# EAGLE schematic DMXtoMotionPCB-v2 (EAGLE 7.5.0)

## Sheet 1 of 2: Sheet1
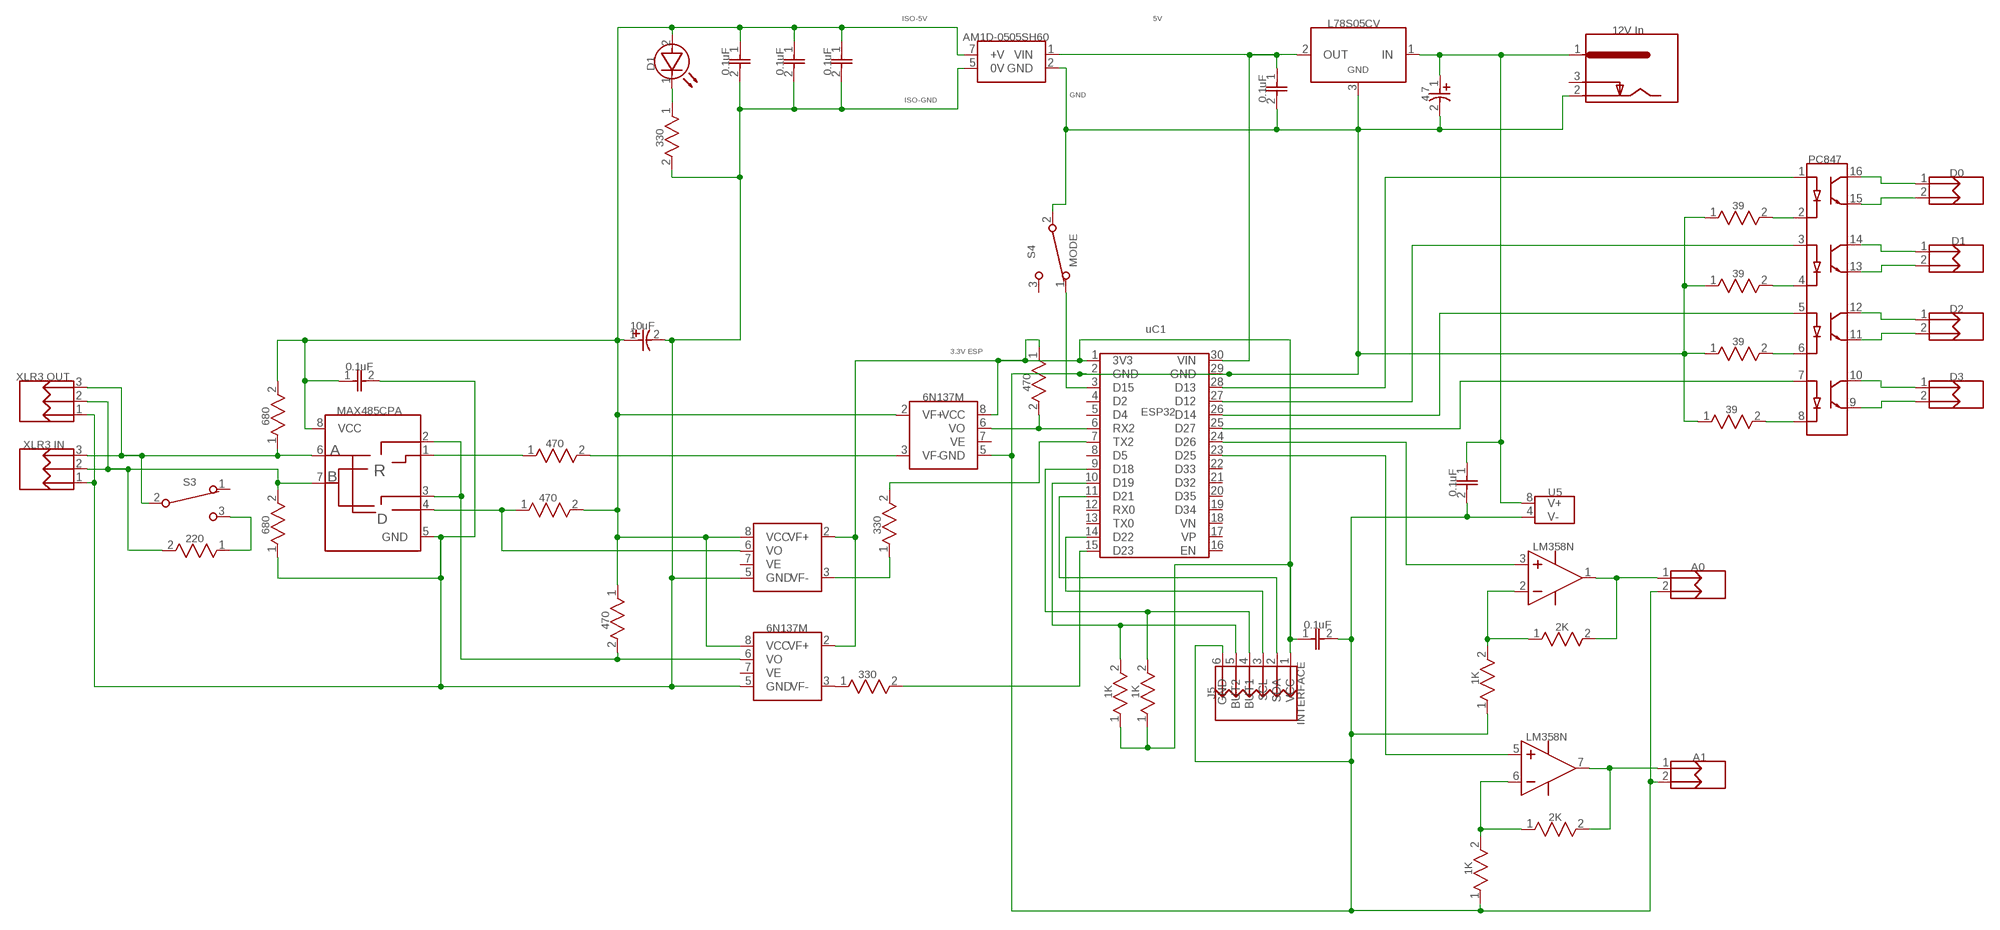
[diagram p0: schematic, sheet 1]

### Parts
C1  0.1uF  CAP_NONPOLARIZED  [CAP-5.08/9.15X3]
C2  0.1uF  CAP_NONPOLARIZED  [CAP-5.08/9.15X3]
C3  0.1uF  CAP_NONPOLARIZED  [CAP-5.08/9.15X3]
C4  4.7  CAP100RP  [CAPPR-2.54/5.08]
C5  10uF  CAP100RP  [CAPPR-2.54/5.08]
C6  0.1uF  CAP_NONPOLARIZED  [CAP-5.08/9.15X3]
C7  0.1uF  CAP_NONPOLARIZED  [CAP-5.08/9.15X3]
C8  0.1uF  CAP_NONPOLARIZED  [CAP-5.08/9.15X3]
C9  0.1uF  CAP_NONPOLARIZED  [CAP-5.08/9.15X3]
D1  LED  [LED100]
J1  12V In  4840-2201  [4840-2211]
J2  XLR3 IN  MOLEX_1X3  [HDR-1X3]
J3  XLR3 OUT  MOLEX_1X3  [HDR-1X3]
J4  D1  MOLEX_1X2  [HDR-1X2]
J5  INTERFACE  MOLEX-1X6  [HDR-1X6]
J6  A0  MOLEX_1X2  [HDR-1X2]
J7  A1  MOLEX_1X2  [HDR-1X2]
J8  D0  MOLEX_1X2  [HDR-1X2]
J9  D3  MOLEX_1X2  [HDR-1X2]
J10  D2  MOLEX_1X2  [HDR-1X2]
R1  330  RES500  [RES-12.7/7.6X2.5]
R2  330  RES500  [RES-12.7/7.6X2.5]
R3  330  RES500  [RES-12.7/7.6X2.5]
R4  470  RES500  [RES-12.7/7.6X2.5]
R5  470  RES500  [RES-12.7/7.6X2.5]
R6  470  RES500  [RES-12.7/7.6X2.5]
R7  680  RES500  [RES-12.7/7.6X2.5]
R8  680  RES500  [RES-12.7/7.6X2.5]
R9  1K  RES500  [RES-12.7/7.6X2.5]
R10  1K  RES500  [RES-12.7/7.6X2.5]
R12  220  RES500  [RES-12.7/7.6X2.5]
R13  470  RES500  [RES-12.7/7.6X2.5]
R14  39  RES500  [RES-12.7/7.6X2.5]
R15  39  RES500  [RES-12.7/7.6X2.5]
R16  39  RES500  [RES-12.7/7.6X2.5]
R17  39  RES500  [RES-12.7/7.6X2.5]
R18  1K  RES500  [RES-12.7/7.6X2.5]
R19  2K  RES500  [RES-12.7/7.6X2.5]
R20  1K  RES500  [RES-12.7/7.6X2.5]
R21  2K  RES500  [RES-12.7/7.6X2.5]
S3  SWITCH_SPDT  [HDRF-1X3T/2.54/8X3]
S4  MODE  SWITCH_SPDT  [HDRF-1X3T/2.54/8X3]
U1  AM1D-0505SH60  [SIP-4(7)/19.5X6X2.54]
U2  MAX485CPA  [DIP-8]
U4  L78S05CV  [TO-220V]
U5  LM358N  [DIP-8]
uC1  ESP32-WROOM-DEVKITV1  [ESP32-DEVKITV1]
VO1  6N137M  [DIP-8]
VO2  6N137M_10  [DIP-8]
VO3  6N137M_10  [DIP-8]
VO4  PC847  [DIP-16]

### Nets
3.3V_ESP [POWER]: C7.1 J5.1(VCC) R9.1(A) R10.1(A) R13.1(A) uC1.1(3V3) VO1.8(VCC) VO2.2(VF+) VO3.2(VF+)
5V [POWER]: C9.1 U1.1(VIN) U4.2(OUT) uC1.30(VIN)
12V [POWER]: C4.1(PLUS) C6.1 J1.1 U4.1(IN) U5.8(VCC_AND_GND:V+)
But1: J5.4(BUT1) R10.2(B) uC1.9(D18)
But2: J5.5(BUT2) R9.2(B) uC1.10(D19)
GND [POWER]: C4.2(MINUS) C6.2 C7.2 C9.2 J1.2 J5.6(GND) J6.2 J7.2 R14.1(A) R15.1(A) R16.1(A) R17.1(A) R18.1(A) R20.1(A) S4.2(C1) U1.2(GND) U4.3(GND) U5.4(VCC_AND_GND:V-) uC1.2(GND) uC1.29(GND) VO1.5(GND)
ISO-5V [POWER]: C1.1 C2.1 C3.1 C5.1(PLUS) C8.1 D1.2(A) R5.2(B) R6.1(A) R7.2(B) U1.7(+V) U2.8(VCC) VO1.2(VF+) VO2.8(VCC) VO3.8(VCC)
ISO-GND [POWER]: C1.2 C2.2 C3.2 C5.2(MINUS) C8.2 J2.1 J3.1 R1.2(B) R8.1(A) U1.5(0V) U2.5(GND) VO2.5(GND) VO3.5(GND)
Net_0: R17.2(B) VO4.2(Cathode)
Net_1: uC1.26(D14) VO4.5(Anode)
Net_2: uC1.25(D27) VO4.7(Anode)
Net_4: D1.1(K) R1.1(A)
Net_6: uC1.28(D13) VO4.1(Anode)
Net_7: uC1.27(D12) VO4.3(Anode)
Net_8: U5.5(PART_2:IN+) uC1.23(D25)
Net_9: R2.1(A) VO2.3(VF-)
Net_10: R3.2(B) uC1.15(D23)
Net_11: R3.1(A) VO3.3(VF-)
Net_12: R4.2(B) VO1.3(VF-)
Net_13: R4.1(A) U2.1(RO)
Net_14: R6.2(B) U2.2(!RE) U2.3(DE) VO3.6(VO)
Net_15: R5.1(A) U2.4(DI) VO2.6(VO)
Net_16: J2.2 J3.2 R8.2(B) R12.2(B) U2.7(B)
Net_17: J2.3 J3.3 R7.1(A) S3.2(C1) U2.6(A)
Net_18: J7.1 R19.2(B) U5.7(PART_2:OUT)
Net_21: R18.2(B) R19.1(A) U5.6(PART_2:IN-)
Net_22: S4.1(C2) uC1.3(D15)
Net_24: U5.3(PART_1:IN+) uC1.24(D26)
Net_32: J5.2(SDA) uC1.11(D21)
Net_33: J5.3(SCL) uC1.14(D22)
Net_34: R12.1(A) S3.3(C3)
Net_35: R14.2(B) VO4.4(Cathode)
Net_36: R15.2(B) VO4.6(Cathode)
Net_37: R16.2(B) VO4.8(Cathode)
Net_38: J8.2 VO4.15(Emitter)
Net_39: J8.1 VO4.16(Collector)
Net_40: J4.1 VO4.14(Collector)
Net_41: J4.2 VO4.13(Emitter)
Net_42: J10.1 VO4.12(Collector)
Net_43: J10.2 VO4.11(Emitter)
Net_44: J9.1 VO4.10(Collector)
Net_45: J9.2 VO4.9(Emitter)
Net_46: J6.1 R21.2(B) U5.1(PART_1:OUT)
Net_47: R20.2(B) R21.1(A) U5.2(PART_1:IN-)
RX: R13.2(B) uC1.6(RX2) VO1.6(VO)
TX: R2.2(B) uC1.7(TX2)
Unconnected: S3.1(C2) S4.3(C3) uC1.4(D2) uC1.5(D4) uC1.8(D5) uC1.12(RX0) uC1.13(TX0) uC1.16(EN) uC1.17(VP) uC1.18(VN) uC1.19(D34) uC1.20(D35) uC1.21(D32) uC1.22(D33) VO1.7(VE) VO2.7(VE) VO3.7(VE)

### Notes on the sheet
- ISO-5V | 5V
- L78S05CV
- 12V In
- AM1D-0505SH60
- GND
- D1
- 0.1uF | 0.1uF | 0.1uF
- GND
- ISO-GND
- 0.1uF | 4.7
- 330
- PC847
- D0
- 39
- D1
- S4
- MODE
- 39
- D2
- 10uF
- uC1
- 39
- 3.3V ESP
- 0.1uF
- XLR3 OUT | D3
- 470
- 6N137M
- ESP32
- MAX485CPA | 39
- 680
- XLR3 IN | 470
- A
- R
- B
- S3
- 0.1uF | U5
- 470
- D
- 680 | 330
- 220
- LM358N
- A0
- 470 | 0.1uF | 2K
- 6N137M
- INTERFACE
- 330
- J5 | 1K
- 1K | 1K
- LM358N
- A1
- 2K
- 1K

## Sheet 2 of 2: Sheet2
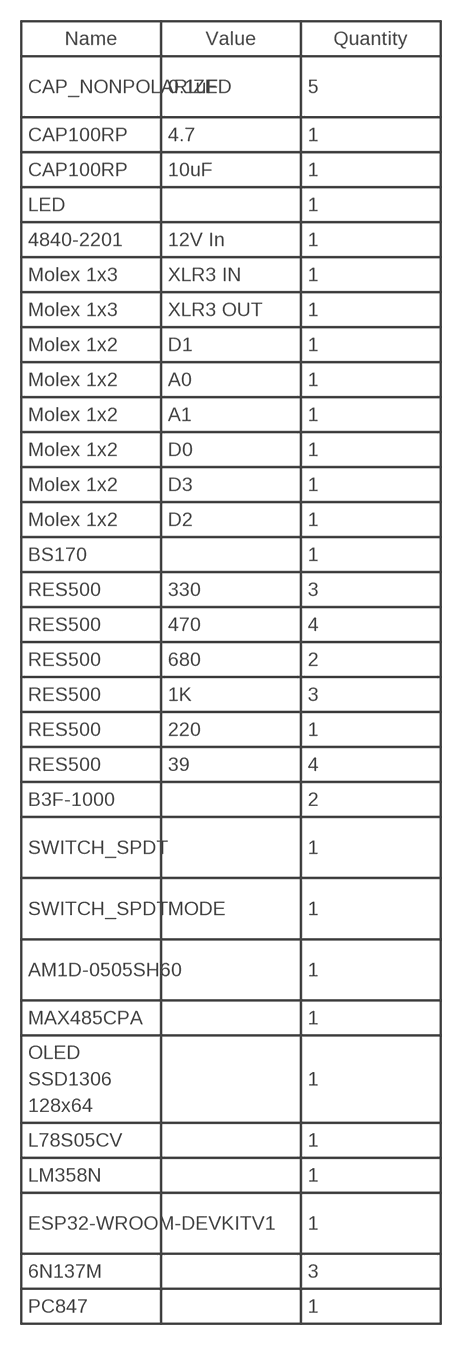
[diagram p1: schematic, sheet 2]

### Notes on the sheet
- Name | Value | Quantity
- CAP_NONPOLARIZED | 0.1uF | 5
- CAP100RP | 4.7 | 1
- CAP100RP | 10uF | 1
- LED | 1
- 4840-2201 | 12V In | 1
- Molex 1x3 | XLR3 IN | 1
- Molex 1x3 | XLR3 OUT | 1
- Molex 1x2 | D1 | 1
- Molex 1x2 | A0 | 1
- Molex 1x2 | A1 | 1
- Molex 1x2 | D0 | 1
- Molex 1x2 | D3 | 1
- Molex 1x2 | D2 | 1
- BS170 | 1
- RES500 | 330 | 3
- RES500 | 470 | 4
- RES500 | 680 | 2
- RES500 | 1K | 3
- RES500 | 220 | 1
- RES500 | 39 | 4
- B3F-1000 | 2
- SWITCH_SPDT | 1
- SWITCH_SPDT | MODE | 1
- AM1D-0505SH60 | 1
- MAX485CPA | 1
- OLED
  SSD1306
  128x64
- 1
- L78S05CV | 1
- LM358N | 1
- ESP32-WROOM-DEVKITV1 | 1
- 6N137M | 3
- PC847 | 1

## Power pins joined to a net without a drawn wire
3: J1.3

## Library data of the parts
C1-C3 C6-C9 = common:CAP_NONPOLARIZED; DESCRIPTION: Non-polarized
C4 = common:CAP100RP
C5 = common:CAP100RP; VALUE: 4.7
D1 = common:LED
J1 = common:4840-2201; DATASHEET: http://datasheets.diptrace.com/con_power/typ_4840.2201.pdf; MANUFACTURER: Schurter
J2 = common:MOLEX_1X3
J3 = common:MOLEX_1X3; VALUE: XLR3 IN
J4 = common:MOLEX_1X2
J5 = common:MOLEX-1X6
J6-J10 = common:MOLEX_1X2; VALUE: D1
R1-R3 = common:RES500
R4-R10 R12-R21 = common:RES500; VALUE: 330
S3 S4 = common:SWITCH_SPDT; DESCRIPTION: Switch; UNTITLED: SPDT; UNTITLED_1: Normally Closed
U1 = common:AM1D-0505SH60; MANUFACTURER: AMTEC
U2 = common:MAX485CPA; DATASHEET: http://datasheets.diptrace.com/maxim/MAX1487-MAX491.pdf; MANUFACTURER: Maxim
U4 = common:L78S05CV; DATASHEET: http://datasheets.diptrace.com/st_micro/CD00000449.pdf; MANUFACTURER: ST Microelectronics
U5 = common:LM358N; DATASHEET: http://datasheets.diptrace.com/motorola/LM158_258_358_2904.pdf; MANUFACTURER: Motorola
uC1 = common:ESP32-WROOM-DEVKITV1; DATASHEET: https://www.espressif.com/sites/default/files/documentation/esp32-wroom-32_datasheet_en.pdf
VO1 = common:6N137M; DATASHEET: http://datasheets.diptrace.com/optoisolators/6N137M.pdf; MANUFACTURER: Fairchild
VO2 VO3 = common:6N137M_10; DATASHEET: http://datasheets.diptrace.com/optoisolators/6N137M.pdf; MANUFACTURER: Fairchild
VO4 = common:PC847; DATASHEET: http://datasheets.diptrace.com/misc/PC817_Series.pdf; MANUFACTURER: Sharp

## Net classes
0 Default: width 0.2 mm, clearance 0.2 mm
1 POWER: width 0.8 mm, clearance 0.4 mm